# EAGLE design ethero_v2 (EAGLE 6.4)
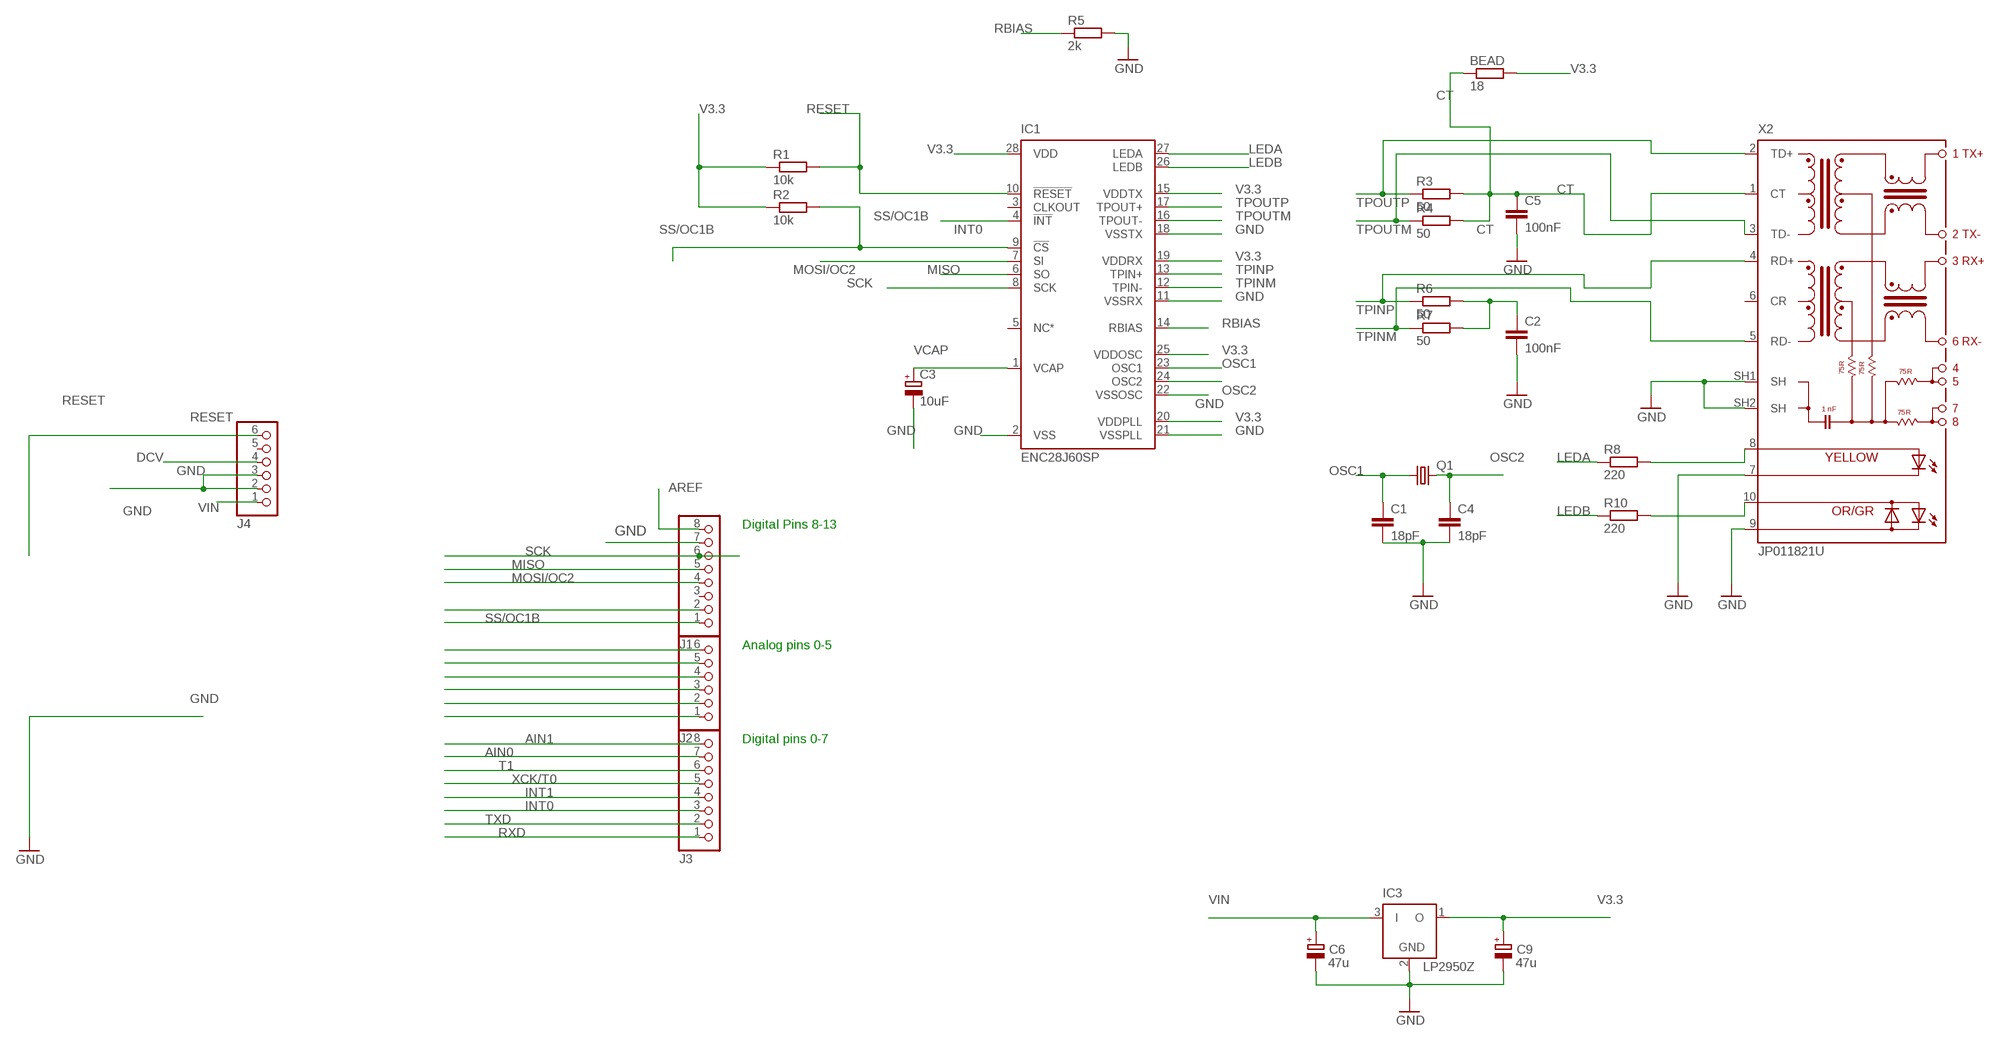
[diagram p0: schematic, sheet 1]

## Parts
BEAD  18  R-EU_0204/7  [0204/7]
C1  18pF  C-EU025-025X050  [C025-025X050]
C2  100nF  C-EU025-025X050  [C025-025X050]
C3  10uF  CPOL-EUE5-5  [E5-5]
C4  18pF  C-EU025-025X050  [C025-025X050]
C5  100nF  C-EU025-025X050  [C025-025X050]
C6  47u  CPOL-EUE3.5-8  [E3,5-8]
C9  47u  CPOL-EUE3.5-8  [E3,5-8]
IC1  ENC28J60SP  [DIL28-3]
IC3  LP2950Z  [TO92]
J1  PINHD-1X8  [1X08]
J2  PINHD-1X6  [1X06]
J3  PINHD-1X8  [1X08]
J4  PINHD-1X6  [1X06]
Q1  CRYSTALHC18U-V  [HC18U-V]
R1  10k  R-EU_0204/7  [0204/7]
R2  10k  R-EU_0204/7  [0204/7]
R3  50  R-EU_0204/7  [0204/7]
R4  50  R-EU_0204/7  [0204/7]
R5  2k  R-EU_0204/7  [0204/7]
R6  50  R-EU_0204/7  [0204/7]
R7  50  R-EU_0204/7  [0204/7]
R8  220  R-EU_0204/7  [0204/7]
R10  220  R-EU_0204/7  [0204/7]
X2  JP011821U  [JP]

## Nets
AIN0: J3.7
AIN1: J3.8
AREF: J1.8
CT: BEAD.1 C5.1 R3.2 R4.2 X2.1(CT)
DCV [power]: J4.4
GND [power]: C1.2 C2.2 C3.- C4.2 C5.2 C6.- C9.- IC1.2(VSS) IC1.11(VSSRX) IC1.18(VSSTX) IC1.21(VSSPLL) IC1.22(VSSOSC) IC3.2(GND) J1.7 J4.2 J4.3 R5.2 X2.7(C-Y) X2.9(A-O_C-G) X2.SH1(SH) X2.SH2(SH)
INT0: IC1.4(!INT) J3.3
INT1: J3.4
LEDA: IC1.27(LEDA) R8.1
LEDB: IC1.26(LEDB) R10.1
MISO: IC1.6(SO) J1.5
MOSI/OC2: IC1.7(SI) J1.4
N$2: J1.2
N$5: C2.1 R6.2 R7.2
N$10: R8.2 X2.8(A-Y)
N$12: R10.2 X2.10(C-O_A-G)
N$16: J2.1
N$17: J2.2
N$18: J2.3
N$19: J2.4
N$20: J2.5
N$21: J2.6
OSC1: C1.1 IC1.23(OSC1) Q1.1
OSC2: C4.1 IC1.24(OSC2) Q1.2
RBIAS: IC1.14(RBIAS) R5.1
RESET: IC1.10(!RESET) J4.6 R1.2
RXD: J3.1
SCK: IC1.8(SCK) J1.6
SS/OC1B: IC1.9(!CS) J1.1 R2.2
T1: J3.6
TPINM: IC1.12(TPIN-) R7.1 X2.5(RD-)
TPINP: IC1.13(TPIN+) R6.1 X2.4(RD+)
TPOUTM: IC1.16(TPOUT-) R4.1 X2.3(TD-)
TPOUTP: IC1.17(TPOUT+) R3.1 X2.2(TD+)
TXD: J3.2
V3.3: BEAD.2 C9.+ IC1.15(VDDTX) IC1.19(VDDRX) IC1.20(VDDPLL) IC1.25(VDDOSC) IC1.28(VDD) IC3.1(O) R1.1 R2.1
VCAP: C3.+ IC1.1(VCAP)
VIN [power]: C6.+ IC3.3(I) J4.1
XCK/T0: J3.5
Unconnected: IC1.3(CLKOUT) IC1.5(NC*) J1.3 J4.5 X2.6(CR)

## Notes on the sheet
- Digital Pins 8-13
- Analog pins 0-5
- Digital pins 0-7

## Library data of the parts
BEAD R1-R8 R10 = resistor:R-EU_: RESISTOR, European symbol
C1 C2 C4 C5 = resistor:C-EU: CAPACITOR, European symbol
C3 C6 C9 = rcl:CPOL-EU: POLARIZED CAPACITOR, European symbol
IC1 = microchip:ENC28J60: Stand-Alone Ethernet Controller with SPI Interface Source: http://ww1.microchip.com/downloads/en/DeviceDoc/39662c.pdf; MF: MICROCHIP; MPN: ENC28J60/SP; OC_FARNELL: 1084619; OC_NEWARK: 96K3661
IC3 = linear:LP2950: 100 mA, Low Power Low Dropout Voltage Regulator Source: http://www.onsemi.com/pub/Collateral/LP2950-D.PDF
J1 J3 = pinhead:PINHD-1X8: PIN HEADER
J2 J4 = pinhead:PINHD-1X6: PIN HEADER
Q1 = crystal:CRYSTAL: CRYSTAL; OC_FARNELL: unknown; OC_NEWARK: unknown
X2 = con-pulse:JP011821U: PULSEJACK (TM) 1x1 Tab-UP RJ45 10/100 Base-TX RJ45 1x1 Tab-UP with LEDs 8-pin (J1 series) and 6-pin (JP series) integrated magnetics connector, designed to support applications, such as ADSL modems, LAN-on-Motherboard, and Hub and Switches. Source: www.pulseeng.com .. PulseJack-J402.pdf; OC_FARNELL: unknown; OC_NEWARK: unknown

## Net classes
0 default: width 0.203 mm, clearance 0.203 mm
1 power: width 0.6 mm, clearance 0.305 mm
2 finepitch: width 0.203 mm, clearance 0.203 mm

## Board
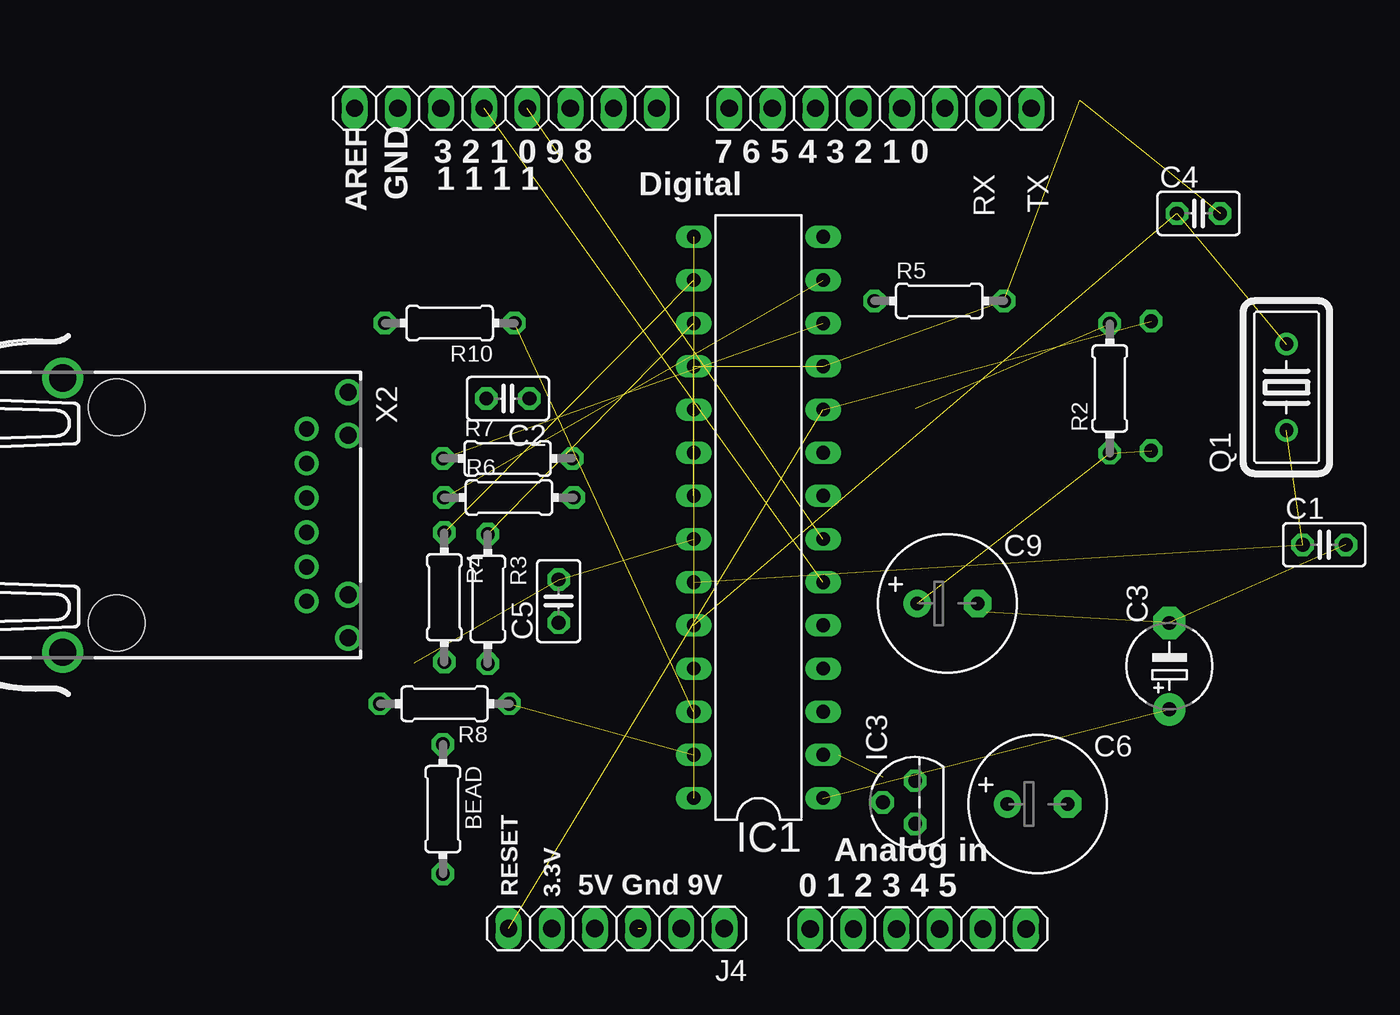
[diagram p1: board, top side]
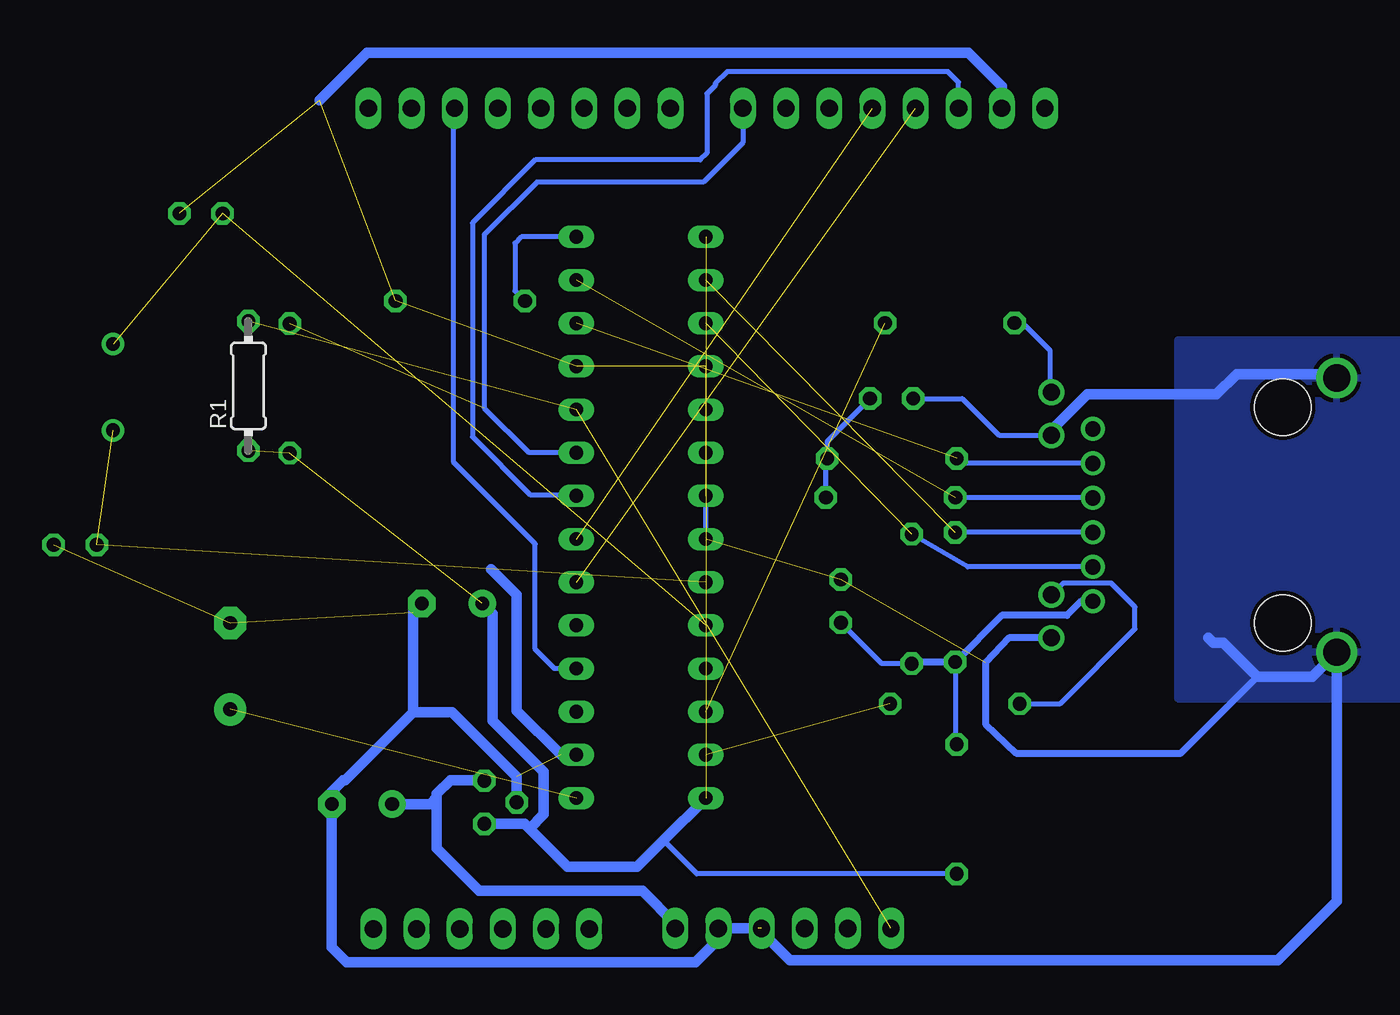
[diagram p2: board, bottom side, seen from below]

No outline drawn. Coordinates in mm, seen from the top.
Copper layers (1*16): Top 0.035mm / dielectric 1.5mm / Bottom 0.035mm
Design rules "default": minimum track width 10mil, minimum drill 0.6mm, track to track 8mil, track to pad 8mil, pad to pad 8mil, via to via 12mil, smd to smd 8mil, copper to edge 10mil, drill to drill 15mil, minimum pad ring 10mil, minimum via ring 12mil, stop-mask expansion 4mil, vias tented up to drill 0mil, thermal gap 10mil
tRestrict: area 13.4,48.9 to 17.2,52.7; area 64.2,33.6 to 68,37.4; area 64.2,5.7 to 68,9.5; 10 lines
bRestrict: area 13.4,48.9 to 17.2,52.7; area 64.2,33.6 to 68,37.4; area 64.2,5.7 to 68,9.5; 8 lines

### Footprints (pad centres in the part's own frame; a part is rotated, then mirrored left to right if it is on the bottom)
0204/7 = drill 0.813 octagon: 1 -3.81,0; 2 3.81,0
C025-025X050 = drill 0.813 octagon: 1 -1.27,0; 2 1.27,0
E5-5 = drill 0.813 pad 1.905: + -2.54,0 | drill 0.813 pad 1.905 octagon: - 2.54,0
E3,5-8 = drill 0.813 pad 1.6: + -1.778,0 | drill 0.813 pad 1.6 octagon: - 1.778,0
DIL28-3 = drill 0.813 long: 1 -16.51,-3.81; 2 -13.97,-3.81; 3 -11.43,-3.81; 4 -8.89,-3.81; 5 -6.35,-3.81; 6 -3.81,-3.81; 7 -1.27,-3.81; 8 1.27,-3.81; 9 3.81,-3.81; 10 6.35,-3.81; 11 8.89,-3.81; 12 11.43,-3.81; 13 13.97,-3.81; 14 16.51,-3.81; 15 16.51,3.81; 16 13.97,3.81; 17 11.43,3.81; 18 8.89,3.81; 19 6.35,3.81; 20 3.81,3.81; 21 1.27,3.81; 22 -1.27,3.81; 23 -3.81,3.81; 24 -6.35,3.81; 25 -8.89,3.81; 26 -11.43,3.81; 27 -13.97,3.81; 28 -16.51,3.81
TO92 = drill 0.813 octagon: 1 -1.27,0; 2 0,1.905; 3 1.27,0
1X08 = drill 1.016 long: 1 -8.89,0; 2 -6.35,0; 3 -3.81,0; 4 -1.27,0; 5 1.27,0; 6 3.81,0; 7 6.35,0; 8 8.89,0
1X06 = drill 1.016 long: 1 -6.35,0; 2 -3.81,0; 3 -1.27,0; 4 1.27,0; 5 3.81,0; 6 6.35,0
HC18U-V = drill 0.813: 1 -2.54,0; 2 2.54,0
JP = drill 0.9 pad 1.3: 1 5.075,11.18; 2 3.045,11.18; 3 1.015,11.18; 4 -1.015,11.18; 5 -3.045,11.18; 6 -5.075,11.18 | drill 1 pad 1.4: 7 7.23,13.62; 8 4.69,13.62; 9 -4.69,13.62; 10 -7.23,13.62 | drill 1.6 pad 2.184: SH1 -8.065,-3.17; SH2 8.065,-3.17 | hole 3.3: 6.35,0; -6.35,0

### Placement (x,y rotation side)
BEAD  29.1,9.6 270 top
C1  80.98,25.15 0 top
C2  32.93,33.76 180 top
C3  71.86,18.01 90 top
C4  73.58,44.65 0 top
C5  35.91,21.84 90 top
C6  64.1,9.9 0 top
C9  58.8,21.7 0 top
IC1  47.67,26.76 90 top
IC3  56.9,10 90 top
J1  32.79,50.84 180 top
J2  57.07,2.55 0 top
J3  54.84,50.84 180 top
J4  39.31,2.58 180 top
Q1  78.75,34.43 90 top
R1  70.79,34.5 90 bottom
R2  68.36,34.35 90 top
R3  31.74,21.97 270 top
R4  29.18,22.07 270 top
R5  58.31,39.5 0 top
R6  32.99,27.93 0 top
R7  32.91,30.23 0 top
R8  29.2,15.8 180 top
R10  29.5,38.2 180 top
X2  9.9,26.9 270 top

### Tracks (layer width: path | path; a pad name or v marks a point on that pad's centre or on a via)
CT
  Bottom 0.305: R4.2 29.18,13.49 BEAD.1 | R3.2 33.5,18.16 C5.1
  Bottom 0.406: X2.1 21.77,21.82 22.6,21 26.44,21 R4.2 31.64,18.26 R3.2
GND  (11 unrouted)
  Bottom 0.305: C2.2 28.76,33.76 26.6,31.6 X2.9 | IC1.22 IC1.21
  Bottom 0.406: X2.7 26.03,19.67 27.4,18.2 27.4,14.6 25.6,12.9 15.9,12.9 11.4,17.4
  Bottom 0.61: 40.8,2.6 38.9,0.7 10.2,0.7 6.73,4.17 X2.SH2 8.16,17.4 11.4,17.4 13.4,19.4 14,19.4 14.27,19.67 | X2.9 23.52,31.88 21.4,34 13.8,34 12.6,35.2 6.96,35.2 X2.SH1 | J4.3 42.5,2.58 | 42.5,2.58 J4.2 | J1.7 26.44,52.14 28.4,54.1 63.8,54.1 66.6,51.3 | IC3.2 54.99,11.49 58.8,15.3 61.1,15.3 | IC1.2 52.39,12.79 55,15.4 55,22.2 56.5,23.7 | 42.5,2.58 44.48,0.6 65,0.6 65.88,1.48 C6.- 65.88,10.62 65.2,11.3 65.1,11.3 61.1,15.3 | 61.1,15.3 61.1,21.18 C9.-
  pour Bottom: -0.6,37.2 16.1,37.2 16.1,36.7 16.1,16.1 -0.7,16.1 -0.7,16.3 -0.6,16.3
INT0
  Bottom 0.305: IC1.4 52.77,17.87 53.9,19 53.9,25.2 58.7,30 58.7,50.79 J3.3
LEDA  (1 unrouted)
LEDB  (1 unrouted)
MISO  (1 unrouted)
MOSI/OC2  (1 unrouted)
N$5
  Bottom 0.305: R6.2 36.8,30.15 R7.2 36.72,31.24 C2.1
N$10
  Bottom 0.305: R8.2 23,15.8 18.6,20.2 18.6,21.5 20,22.9 22.83,22.9 X2.8
N$12
  Bottom 0.305: R10.2 25.2,38.2 23.6,36.6 23.6,34.21 X2.10
OSC1  (2 unrouted)
OSC2  (2 unrouted)
RBIAS
  Bottom 0.305: IC1.14 54.73,43.27 55.1,42.9 55.1,40.1 R5.1
RESET  (2 unrouted)
SCK
  Bottom 0.305: J1.6 28.98,52.38 29.6,53 42.6,53 43.3,52.3 43.3,52.2 43.8,51.7 43.8,48.2 44.2,47.8 53.9,47.8 57.6,44.1 57.6,31.5 54.2,28.1 51.55,28.1 IC1.8
SS/OC1B  (1 unrouted)
  Bottom 0.305: J1.1 41.68,48.82 44,46.5 53.8,46.5 56.9,43.4 56.9,33.2 54.3,30.6 51.51,30.6 IC1.9
TPINM  (1 unrouted)
  Bottom 0.305: X2.5 28.81,29.95 R7.1
TPINP  (1 unrouted)
  Bottom 0.305: X2.4 29.16,27.91 R6.1
TPOUTM  (1 unrouted)
  Bottom 0.305: X2.3 28.85,25.89 R4.1
TPOUTP  (1 unrouted)
  Bottom 0.305: X2.2 28.45,23.86 R3.1
V3.3  (6 unrouted)
  Bottom 0.305: BEAD.2 44.39,5.79 46.36,7.76
  Bottom 0.61: IC3.1 54.53,8.73 54.25,8.45 | 54.25,8.45 52,6.2 47.92,6.2 46.36,7.76 IC1.28 | C9.+ 57,21.7 56.4,21.1 56.4,14.8 53.4,11.8 53.4,9.3 54.25,8.45
VCAP  (1 unrouted)
VIN
  Bottom 0.61: J4.1 45.66,2.86 47.6,4.8 57.2,4.8 59.7,7.3 59.7,10.3 | 59.7,10.3 59.7,10.5 58.9,11.3 56.93,11.3 IC3.3 | C6.+ 60.1,9.9 59.7,10.3

### Text on the board
tPlace: RESET | 3.3V
tNames: 3 2 1 0 9 8 | 7 6 5 4 3 2 1 0 | RX | TX | 1 1 1 1 | Digital | AREF | GND | Analog in | 5V Gnd 9V | 0 1 2 3 4 5
Edit History: 20070917 WestfW: Move (CC) symbol, use silk_gen to get 5mil widths | 20070917 WestfW: Manual route some, autoroute rest. Fiddle. | 20070917 WestfW: Now V1.16. Change components to TH. | 20070911 WestfW: Now V1.15. Move tracks slightly for shielding | 20070900 Daniel: Schematic and initial placement
_tsilk: C12 | C8 | 3 2 1 0 9 8 | 7 6 5 4 3 2 1 0 | RX | TX | 1 1 1 1 | Digital | X2 | AREF | GND | R7 | PWM | PWM | PWM | PWM | PWM | PWM | PWR | IC1 | 13 | Freeduino | FT232RL | c | c | R10 | V1.16 | TX | R8 | RX | 16Mhz | 1 | R1 | R9 | C3 | C10 | R12 | ]USB | R11 | ]EXT | F1 | Q1 | C2 | ICSP | RESET | 1 | CRS | M. Banzi | D. Cuartielles | D. Mellis | N. Zambetti | C5 | C4 | ATMEGA168 | IC2 | D1 | C1 | 47u | C7 | 47u | C6 | C9 | Analog in | 5V Gnd 9V | RESET | 3.3V | 0 1 2 3 4 5 | 9V in